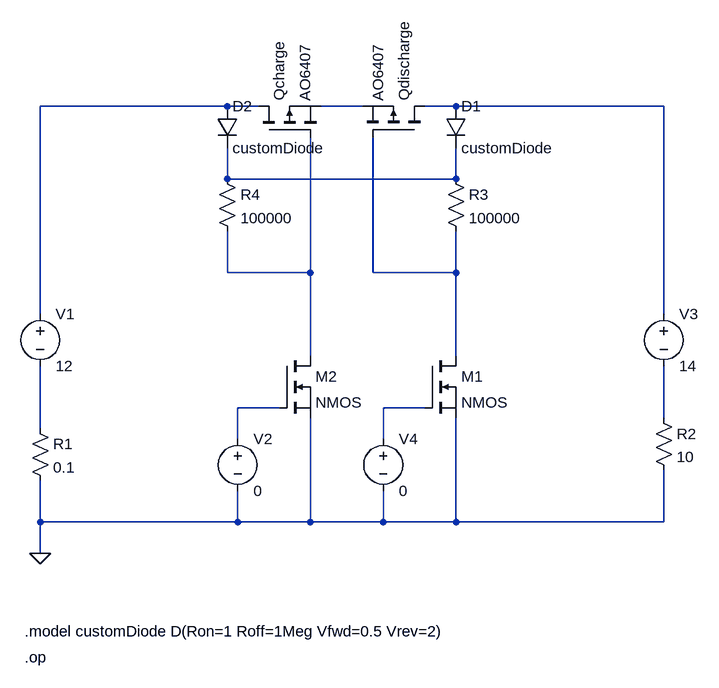
[diagram p0: schematic charge_and_discharge_fets.asc]
charge_and_discharge_fets.asc, the LTspice schematic file:
Version 4
SHEET 1 1156 680
WIRE 208 -352 -80 -352
WIRE 256 -352 208 -352
WIRE 416 -352 352 -352
WIRE 560 -352 512 -352
WIRE 880 -352 560 -352
WIRE 208 -240 208 -288
WIRE 560 -240 560 -288
WIRE 560 -240 208 -240
WIRE 208 -96 208 -160
WIRE 336 -96 336 -304
WIRE 336 -96 208 -96
WIRE 432 -96 432 -304
WIRE 560 -96 560 -160
WIRE 560 -96 432 -96
WIRE -80 -32 -80 -352
WIRE 880 -32 880 -352
WIRE 336 32 336 -96
WIRE 560 32 560 -96
WIRE 288 112 224 112
WIRE 512 112 448 112
WIRE 880 128 880 48
WIRE -80 144 -80 48
WIRE 224 160 224 112
WIRE 448 160 448 112
WIRE -80 288 -80 224
WIRE 224 288 224 240
WIRE 224 288 -80 288
WIRE 336 288 336 128
WIRE 336 288 224 288
WIRE 448 288 448 240
WIRE 448 288 336 288
WIRE 560 288 560 128
WIRE 560 288 448 288
WIRE 880 288 880 208
WIRE 880 288 560 288
WIRE -80 336 -80 288
FLAG -80 336 0
DATAFLAG 864 -352 ""
DATAFLAG -32 -352 ""
DATAFLAG -32 -352 ""
DATAFLAG 64 192 "I(R1)"
DATAFLAG 480 -96 ""
DATAFLAG 288 -96 ""
DATAFLAG 384 -240 ""
SYMBOL res -96 128 R0
SYMATTR InstName R1
SYMATTR Value 0.1
SYMBOL voltage -80 -48 R0
WINDOW 123 0 0 Left 0
WINDOW 39 0 0 Left 0
SYMATTR InstName V1
SYMATTR Value 12
SYMBOL voltage 880 -48 R0
WINDOW 123 0 0 Left 0
WINDOW 39 0 0 Left 0
SYMATTR InstName V3
SYMATTR Value 14
SYMBOL res 864 112 R0
SYMATTR InstName R2
SYMATTR Value 10
SYMBOL pmos 256 -304 R270
SYMATTR InstName Qcharge
SYMATTR Value AO6407
SYMBOL pmos 512 -304 M270
SYMATTR InstName Qdischarge
SYMATTR Value AO6407
SYMBOL voltage 448 144 R0
WINDOW 123 0 0 Left 0
WINDOW 39 0 0 Left 0
SYMATTR InstName V4
SYMATTR Value 0
SYMBOL nmos 512 32 R0
SYMATTR InstName M1
SYMBOL diode 544 -352 R0
SYMATTR InstName D1
SYMATTR Value customDiode
SYMBOL diode 192 -352 R0
SYMATTR InstName D2
SYMATTR Value customDiode
SYMBOL res 544 -256 R0
SYMATTR InstName R3
SYMATTR Value 100000
SYMBOL voltage 224 144 R0
WINDOW 123 0 0 Left 0
WINDOW 39 0 0 Left 0
SYMATTR InstName V2
SYMATTR Value 0
SYMBOL nmos 288 32 R0
SYMATTR InstName M2
SYMBOL res 192 -256 R0
SYMATTR InstName R4
SYMATTR Value 100000
TEXT -104 496 Left 2 !.op
TEXT -104 456 Left 2 !.model customDiode D(Ron=1 Roff=1Meg Vfwd=0.5 Vrev=2)

The netlist it stands for:
* charge_and_discharge_fets.asc
R1 N010 0 0.1
V1 N001 N010 12
V3 N003 N009 14
R2 N009 0 10
M§Qcharge N001 N005 N002 N002 AO6407
M§Qdischarge N003 N006 N002 N002 AO6407
V4 N008 0 0
M1 N006 N008 0 0 NMOS
D1 N003 N004 customDiode
D2 N001 N004 customDiode
R3 N004 N006 100000
V2 N007 0 0
M2 N005 N007 0 0 NMOS
R4 N004 N005 100000
.model D D
.lib standard.dio
.model NMOS NMOS
.model PMOS PMOS
.lib standard.mos
.op
.model customDiode D(Ron=1 Roff=1Meg Vfwd=0.5 Vrev=2)
.backanno
.end